# EAGLE design crocopoi-v1.5 (EAGLE 9.1.2)
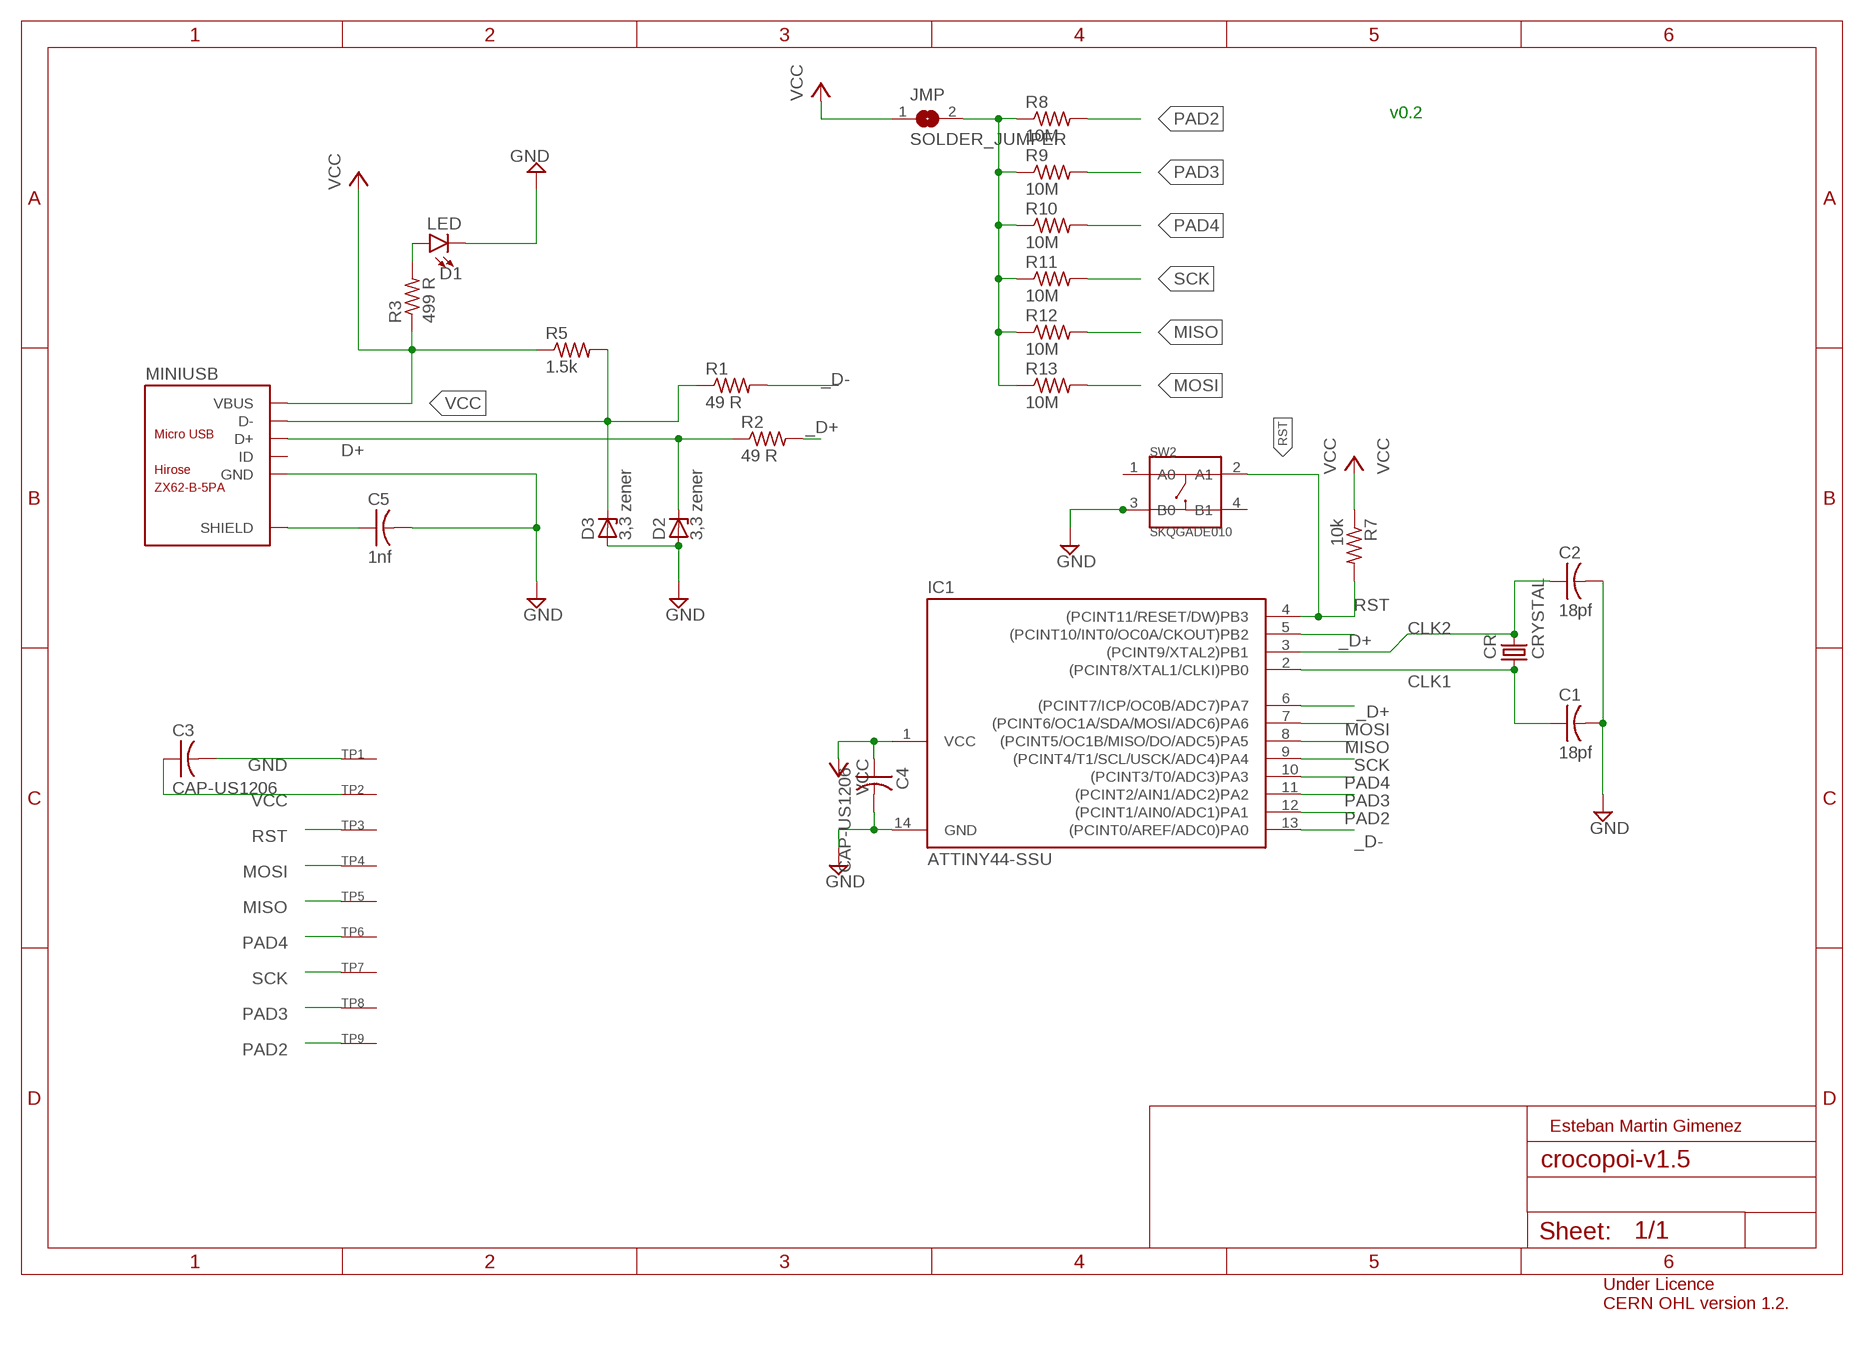
[diagram p0: schematic, sheet 1]

## Parts
C1  18pf  CAP-US1206FAB  [C1206FAB]
C2  18pf  CAP-US1206FAB  [C1206FAB]
C3  CAP-US1206  [C1206]
C4  CAP-US1206  [C1206]
C5  1nf  CAP-US1206FAB  [C1206FAB]
CR  CRYSTAL  [2-SMD-5X3MM]
D1  LED  LED1206  [LED-1206]
D2  3,3 zener  ZENER_DIODESOD123  [SOD123]
D3  3,3 zener  ZENER_DIODESOD123  [SOD123]
IC1  ATTINY44-SSU  [SOIC14]
JMP  SOLDER_JUMPER  [SJFAB]
MINIUSB  ZX62-B-5PA  MICRO-USB-SMD(ZX62-B-5PA)  [MICRO-USB5+6P-SMD-0.65-AB]
R1  49 R  RES-US1206FAB  [R1206FAB]
R2  49 R  RES-US1206FAB  [R1206FAB]
R3  499 R  RES-US1206FAB  [R1206FAB]
R5  1.5k  RES-US1206FAB  [R1206FAB]
R7  10k  RES-US1206FAB  [R1206FAB]
R8  10M  RES-US1206FAB  [R1206FAB]
R9  10M  RES-US1206FAB  [R1206FAB]
R10  10M  RES-US1206FAB  [R1206FAB]
R11  10M  RES-US1206FAB  [R1206FAB]
R12  10M  RES-US1206FAB  [R1206FAB]
R13  10M  RES-US1206FAB  [R1206FAB]
SW2  SKQGADE010  SMD-BUTTON(4P-5.2X5.2X1.5MM-SKQGADE010)-SKQGADE010  [SW4-SMD-5.2X5.2X1.5MM]
TP1  SEWTAPBIG  [BIGTAP]
TP2  SEWTAPBIG  [BIGTAP]
TP3  SEWTAPBIG  [BIGTAP]
TP4  SEWTAPBIG  [BIGTAP]
TP5  SEWTAPBIG  [BIGTAP]
TP6  SEWTAPBIG  [BIGTAP]
TP7  SEWTAPBIG  [BIGTAP]
TP8  SEWTAPBIG  [BIGTAP]
TP9  SEWTAPBIG  [BIGTAP]

## Nets
_D+: IC1.5((PCINT10/INT0/OC0A/CKOUT)PB2) IC1.6((PCINT7/ICP/OC0B/ADC7)PA7) R2.2
_D-: IC1.13((PCINT0/AREF/ADC0)PA0) R1.2
CLK1: C1.1 CR.P$1 IC1.2((PCINT8/XTAL1/CLKI)PB0)
CLK2: C2.1 CR.P$2 IC1.3((PCINT9/XTAL2)PB1)
D+: D2.CATHODE MINIUSB.3(D+) R2.1
D-: D3.CATHODE MINIUSB.2(D-) R1.1 R5.2
GND: C1.2 C2.2 C3.2 C4.2 C5.2 D1.C D2.ANODE D3.ANODE IC1.14(GND) MINIUSB.5(GND) SW2.3(B0) TP1.P$1(SEW)
MISO: IC1.8((PCINT5/OC1B/MISO/DO/ADC5)PA5) R12.2 TP5.P$1(SEW)
MOSI: IC1.7((PCINT6/OC1A/SDA/MOSI/ADC6)PA6) R13.2 TP4.P$1(SEW)
N$1: JMP.2 R8.1 R9.1 R10.1 R11.1 R12.1 R13.1
N$8: D1.A R3.2
PAD2: IC1.12((PCINT1/AIN0/ADC1)PA1) R8.2 TP9.P$1(SEW)
PAD3: IC1.11((PCINT2/AIN1/ADC2)PA2) R9.2 TP8.P$1(SEW)
PAD4: IC1.10((PCINT3/T0/ADC3)PA3) R10.2 TP6.P$1(SEW)
RST: IC1.4((PCINT11/RESET/DW)PB3) R7.2 SW2.2(A1) TP3.P$1(SEW)
SCK: IC1.9((PCINT4/T1/SCL/USCK/ADC4)PA4) R11.2 TP7.P$1(SEW)
SHIELD: C5.1 MINIUSB.P1(SHIELD) MINIUSB.P2(SHIELD) MINIUSB.P3(SHIELD) MINIUSB.P4(SHIELD) MINIUSB.P5(SHIELD) MINIUSB.P6(SHIELD)
VCC: C3.1 C4.1 IC1.1(VCC) JMP.1 MINIUSB.1(VBUS) R3.1 R5.1 R7.1 TP2.P$1(SEW)
Unconnected: MINIUSB.4(ID) SW2.1(A0) SW2.4(B1)

## Notes on the sheet
- v0.2
- Esteban Martin Gimenez
- Under Licence 
  CERN OHL version 1.2.

## Library data of the parts
C1-C5 = fab:CAP-US
CR = fab:CRYSTAL
D1 = SparkFun-LED:LED: LED (Generic) Standard schematic elements and footprints for 5mm, 3mm, 1206, and 0603 sized LEDs. Generic LEDs with no color specified.
D2 D3 = fab:ZENER_DIODE: zener diode
IC1 = fab:ATTINY44
JMP = fab:SOLDER_JUMPER
MINIUSB = Seeed-Connector:MICRO-USB-SMD(ZX62-B-5PA): 320010005; MPN: ZX62-B-5PA
R1-R3 R5 R7-R13 = fab:RES-US: Resistor (US Symbol) Variants with postfix FAB are widened to allow the routing of internal traces
SW2 = Seeed-Switch:SMD-BUTTON(4P-5.2X5.2X1.5MM-SKQGADE010): 311020017; MPN: SKQGADE010
TP1-TP9 = adafruit:SEWTAP

## Board
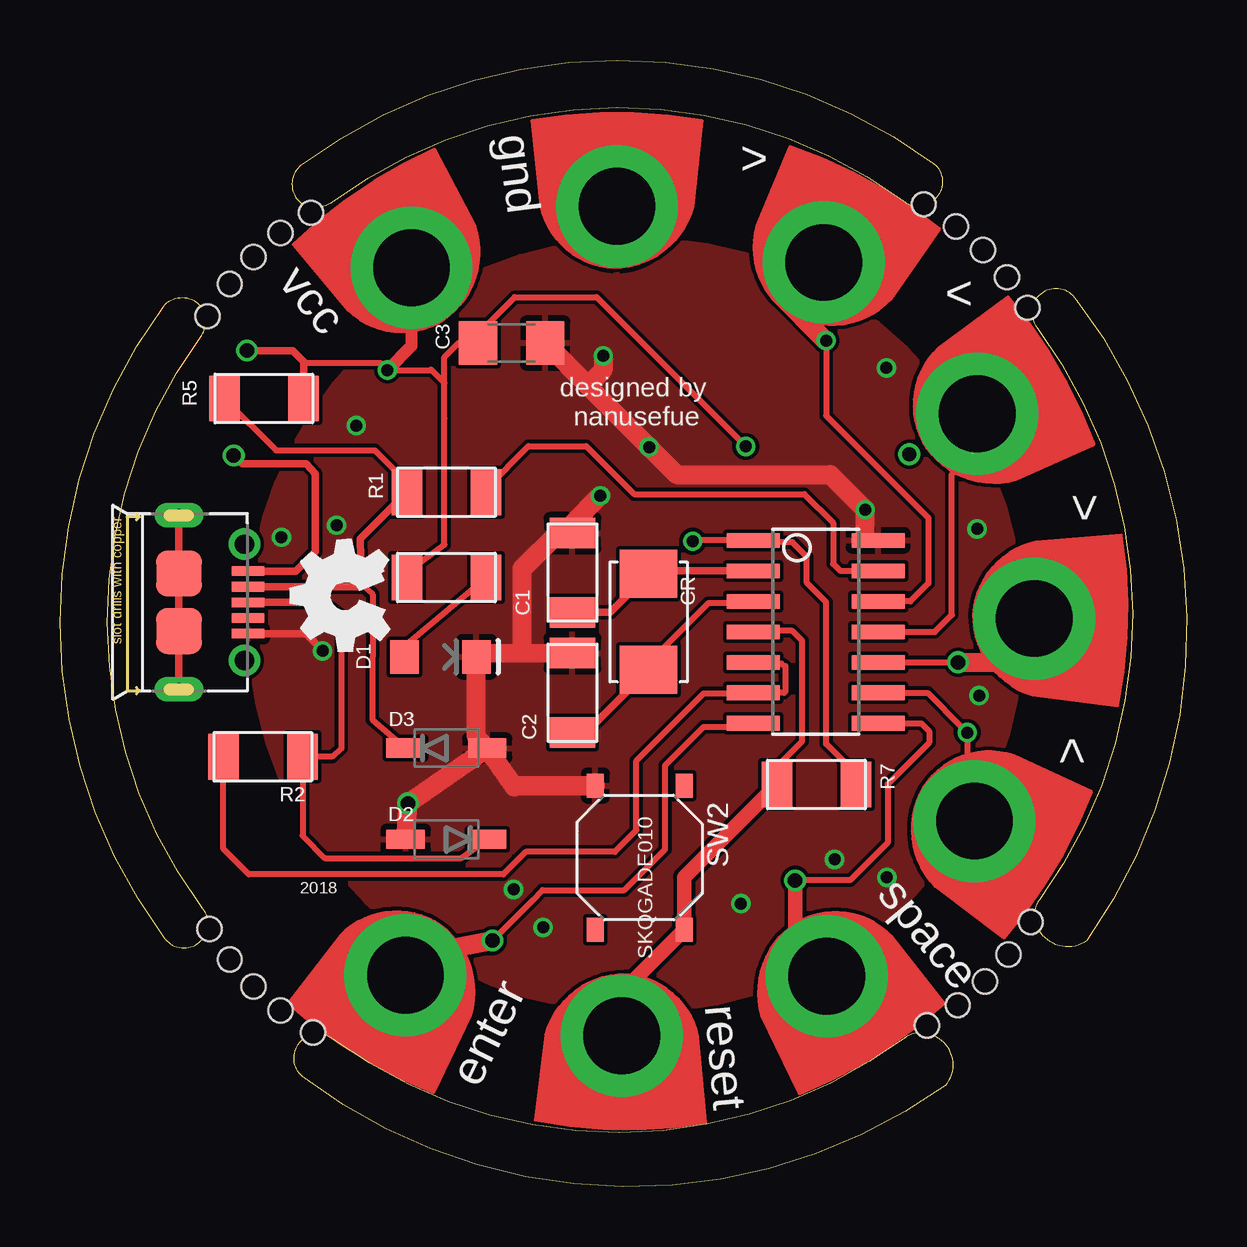
[diagram p1: board, top side]
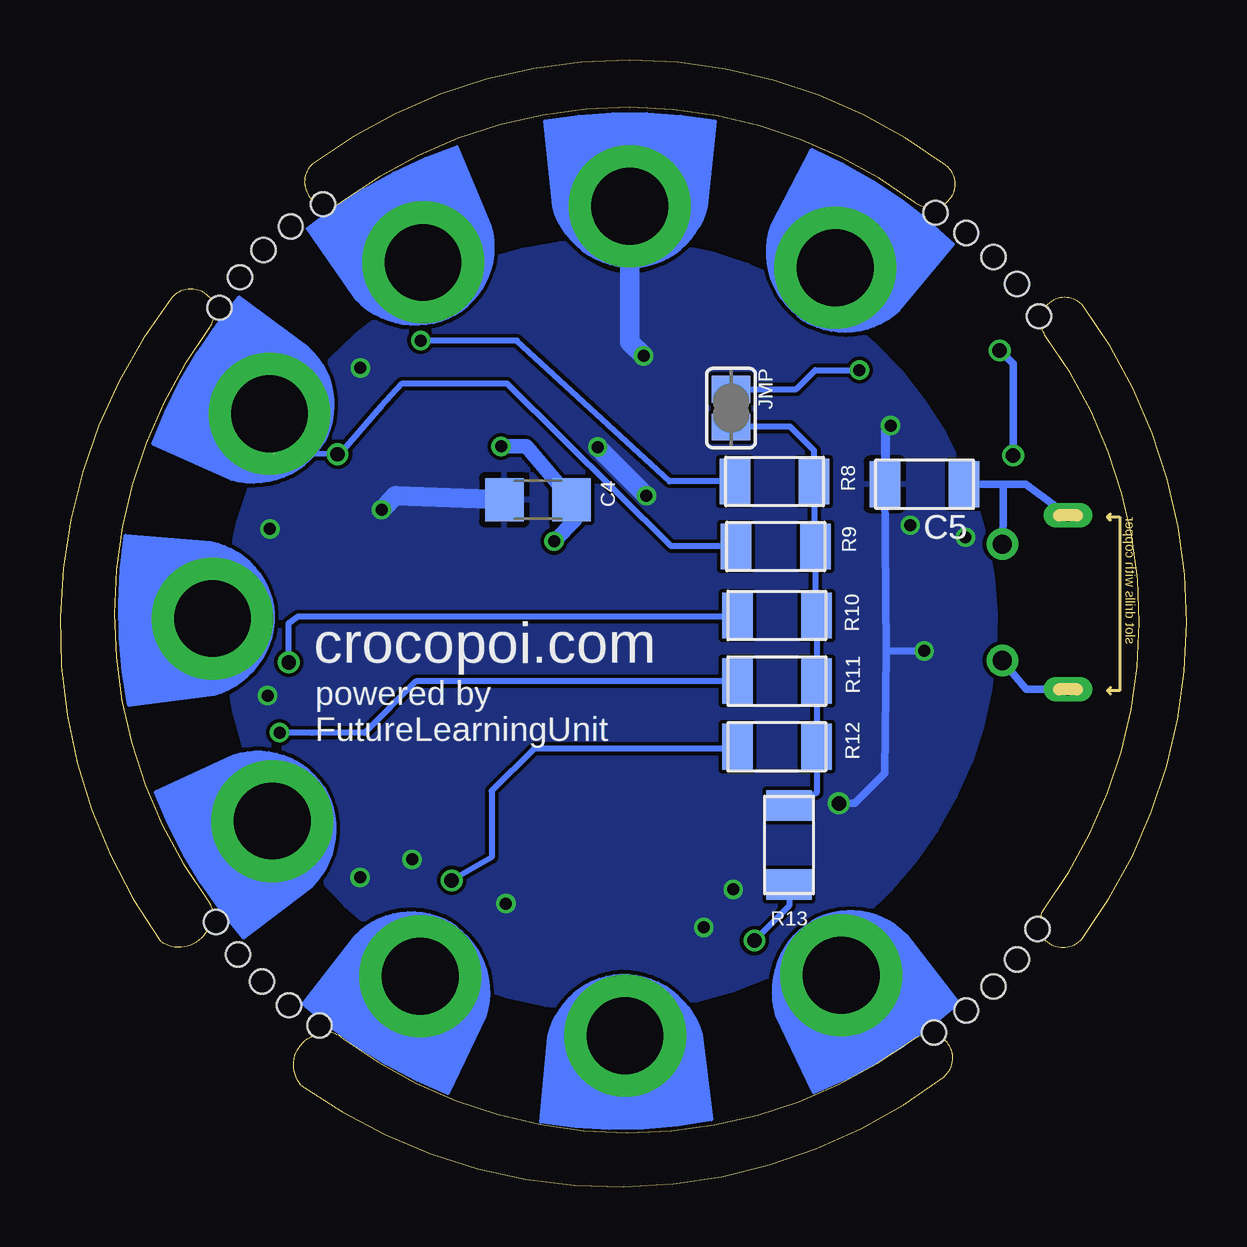
[diagram p2: board, bottom side, seen from below]

Size 46.95 x 46.95 mm. Coordinates in mm from the lower left corner, seen from the top.
Outline: 11.31,41 arc-73 35.14,41.08 arc23 35.48,40.9
Outline: 4.31,36.7 arc73 4.38,10.32 arc101 5.94,10.32
Outline: 4.31,36.7 arc-101 5.88,36.68 arc101 4.31,36.7
Outline: 10.11,40.94 arc-107 10.04,42.57 arc-73 36.42,42.64 arc-96 36.45,41.15
Outline: 11.31,41.01 arc-24 10.9,40.83
Outline: 6.04,35.78 arc-18 5.87,35.42 arc73 5.94,11.6 arc-23 6.11,11.24
Outline: 40.72,35.79 arc-73 40.8,11.95 arc23 40.6,11.51
Outline: 40.66,36.98 arc-107 42.29,37.05 arc-73 42.78,10.25 arc-96 40.8,10.69
Outline: 40.73,35.78 arc-24 40.55,36.2
Outline: 10.11,4.6 arc73 36.91,4.24 arc107 36.42,6.29
Outline: 10.11,4.6 arc-101 10.13,6.16 arc101 10.11,4.6
Outline: 11.03,6.32 arc-18 11.38,6.15 arc73 35.21,6.22 arc-31 35.71,6.43
Copper layers (1*16): Top 0.035mm / dielectric 1.5mm / Bottom 0.035mm
Design rules "SeeedStudio_2layer_DRU_no_angle_20140221": minimum track width 6mil, minimum drill 12mil, track to track 6mil, track to pad 6mil, pad to pad 6mil, via to via 6mil, smd to smd 0mil, copper to edge 10mil, drill to drill 10mil, minimum pad ring 10mil, minimum via ring 6mil, stop-mask expansion 2mil, vias tented up to drill 100mil, thermal gap 10mil
Holes 1 mm at 6.22,10.75 10.54,6.43 8.06,8.34 7.07,9.47 9.19,7.35 10.47,40.59 9.19,39.74 8.06,38.75 7.07,37.62 6.15,36.27 35.99,40.94 37.34,40.02 38.47,39.03 40.3,36.63 39.46,37.9 40.45,11.03 39.53,9.69 38.54,8.56 37.41,7.57 36.13,6.72

### Footprints (pad centres in the part's own frame; a part is rotated, then mirrored left to right if it is on the bottom)
C1206FAB = smd 1.27 x 1.905: 1 -1.651,0; 2 1.651,0
C1206 = smd 1.6 x 1.8: 1 -1.4,0; 2 1.4,0
2-SMD-5X3MM = smd 2 x 2.4: P$1 -2,0; P$2 2,0
LED-1206 = smd 1.2 x 1.4: A -1.5,0; C 1.5,0
SOD123 = smd 1.6 x 0.8: ANODE 1.7,0; CATHODE -1.7,0
SOIC14 = smd 0.61 x 2.21: 1 -3.81,-2.603; 2 -2.54,-2.603; 3 -1.27,-2.603; 4 0,-2.603; 5 1.27,-2.603; 6 2.54,-2.603; 7 3.81,-2.603; 8 3.81,2.603; 9 2.54,2.603; 10 1.27,2.603; 11 0,2.603; 12 -1.27,2.603; 13 -2.54,2.603; 14 -3.81,2.603
SJFAB = smd 1.118 x 1.6: 1 -0.787,0; 2 0.787,0
MICRO-USB5+6P-SMD-0.65-AB = smd 0.4 x 1.35: 1 -1.3,2.875; 2 -0.65,2.875; 3 0,2.875; 4 0.65,2.875; 5 1.3,2.875 | smd 1.9 x 1.9: P1 -1.2,0; P2 1.2,0 | drill 0.508 pad 1.016 long: P3 -3.625,0; P4 3.625,0 | drill 0.8: P5 -2.425,2.73; P6 2.425,2.73
R1206FAB = smd 1.27 x 1.905: 1 -1.651,0; 2 1.651,0
SW4-SMD-5.2X5.2X1.5MM = smd 1 x 0.7: 1 -3,1.85; 2 3,1.85; 3 -3,-1.85; 4 3,-1.85
BIGTAP = drill 3.2 pad 5.08: P$1 0,0

### Placement (x,y rotation side)
C1  21.35,25.59 90 top
C2  21.35,20.58 90 top
C3  18.82,35.16 0 top
C4  27.03,28.62 180 bottom
C5  10.93,29.28 180 bottom
CR  24.53,23.54 270 top
D1  15.85,22.08 0 top
D2  16.1,14.48 180 top
D3  16.1,18.28 0 top
IC1  31.49,23.12 270 top
JMP  18.99,32.45 270 bottom
MINIUSB  4.96,24.35 270 top
R1  16.1,28.94 0 top
R2  8.45,17.92 180 top
R3  16.1,25.38 0 top
R5  8.5,32.84 180 top
R7  31.52,16.76 180 top
R8  17.18,29.39 180 bottom
R9  17.13,26.68 180 bottom
R10  17.08,23.8 180 bottom
R11  17.08,21.07 180 bottom
R12  17.08,18.34 180 bottom
R13  16.57,14.24 270 bottom
SW2  24.16,13.72 270 top
TP1  23.21,40.86 0 top
TP2  14.65,38.3 33.8 top
TP3  23.41,6.29 179.2 top
TP4  14.39,8.82 211.6 bottom
TP5  31.94,8.78 211.8 top
TP6  40.6,23.68 268.8 top
TP7  38.1,15.24 239 top
TP8  38.22,32.22 300.3 top
TP9  31.82,38.52 331.3 top

### Tracks (layer width: path | path; a pad name or v marks a point on that pad's centre or on a via)
_D+
  Top 0.254: 19.41,13.96 18.48,13.02 7.87,13.02 6.8,14.09 R2.2
  Top 0.26: 19.41,13.96 23.12,13.96 24.02,14.86 24.02,17.76 26.82,20.56 28.86,20.56 IC1.6 30.17,20.58 30.23,20.65 30.23,21.69 30.06,21.8 28.93,21.8 IC1.5
_D-
  Top 0.26: IC1.13 32.52,25.66 32.22,25.96 32.22,27.66 31.02,28.86 23.92,28.86 21.92,30.86 19.52,30.86 17.75,29.1 R1.2
CLK1
  Top 0.305: C1.1 22.92,23.94 CR.P$1 24.65,25.66 IC1.2
CLK2
  Top 0.26: IC1.3 28.81,24.32 27.01,24.32 24.53,21.83
  Top 0.305: C2.1 21.92,18.93 CR.P$2 24.53,21.83
D+
  Top 0.254: 11.72,23.8 11.72,18.27 11.33,17.93 R2.1 10.11,14.63 10.15,14.59
  Top 0.26: 10.15,14.59 11.04,13.7 16.71,13.7 D2.CATHODE
  Top 0.305: MINIUSB.3 10.97,24.35 11.72,23.8
D-
  Top 0.254: R5.2 9.01,30.68 13.12,30.68 14.45,29.35 R1.1
  Top 0.26: 12.56,25.35 12.62,25.06 13.02,24.68 13.02,19.46 D3.CATHODE
  Top 0.305: R1.1 12.51,27 12.56,25.35 12.55,25 MINIUSB.2
GND  (via drill 0.5, 0.5 pad 0.81, 0.6)
  Top 0.16: 33.34,26.93 33.55,27.15
  Top 0.305: MINIUSB.5 10.26,23.05 v10.94,22.33
  Top 0.31: IC1.14 33.34,26.93
  Top 0.8: D2.ANODE v14.5,15.98 D3.ANODE | 18.92,16.66 D3.ANODE | 33.55,27.15 v33.55,28.21 32.09,29.67 25.71,29.67 24.56,30.82 | D3.ANODE 17.35,18.73 D1.C 17.75,22.23 19.27,22.25 | 19.27,22.25 C2.2 | 19.27,22.25 19.27,25.74 | C3.2 21.99,33.39 | 21.99,33.39 24.56,30.82 | C1.2 21.39,27.65 v22.52,28.79 | v24.54,30.82 24.56,30.82 | v22.63,34.62 22.63,34.03 21.99,33.39
  Top 0.813: SW2.3 18.98,16.72 18.92,16.66 | 19.27,25.74 20.77,27.24 C1.2
  Bottom 0.305: v12.34,31.72 12.58,31.48 C5.2 12.53,22.32 | v10.94,22.33 12.53,22.32 | 12.53,22.32 12.58,17.23 13.84,15.98 v14.5,15.98 | 12.52,29.72 12.52,31.93
  Bottom 0.8: 33,28.77 v33.55,28.21 | v22.52,28.79 v24.54,30.82
  Bottom 0.813: C4.2 32.97,28.8 33,28.77 | TP1.P$1 23.21,35.19 v22.63,34.62
  other vias: 20.13,10.81 18.9,12.39 11.52,27.57 28.37,11.8 32.28,13.65 38.21,27.41 34.43,34.12 34.45,12.9 38.3,20.46 9.22,27.07
  pour Top: 9.07,29.37 arc-180 38.95,17.43 arc-180
  pour Bottom: 22,7.51 arc180 26.07,39.3 arc180
MISO  (via drill 0.6)
  Top 0.254: IC1.8 35.89,19.31 36.22,18.99 36.22,18.51 34.49,16.78 34.49,14.32 34.48,14.32 32.93,12.78 v30.63,12.76
  Top 0.61: v30.63,12.76 30.63,10.24 TP5.P$1
  Bottom 0.254: 25.72,18.26 27.2,18.26 28.96,16.5 28.96,13.73 v30.63,12.76
  Bottom 0.26: R12.2 18.62,18.26 25.72,18.26
MOSI  (via drill 0.6)
  Top 0.26: v18.02,10.26 19.72,11.96 20.1,12.36 23.52,12.36 25.22,14.06 25.22,17.56 26.82,19.16 28.73,19.16 IC1.7
  Top 0.8: v18.02,10.26 15.22,9.71 TP4.P$1
  Bottom 0.254: R13.2 16.57,11.71 v18.02,10.26
N$1
  Bottom 0.254: R8.1 15.53,30.67 16.53,31.68 18.97,31.68 JMP.2
  Bottom 0.26: R8.1 15.53,26.73 R9.1 15.48,23.85 R10.1 R11.1 R12.1 15.43,16.41 R13.1
N$8
  Top 0.26: D1.A 14.58,22.08 14.58,22.71 R3.2
PAD2  (via drill 0.5)
  Top 0.254: v31.92,35.26 31.92,32.14 36.18,27.88 36.18,25.14 35.43,24.39 IC1.12
  Top 0.26: v31.92,35.26 v31.91,35.25
  Top 0.8: v31.91,35.25 29.92,37.26 29.88,40.56 TP9.P$1
  Bottom 0.26: R8.2 21.55,29.39 27.92,35.26 v31.92,35.26
PAD3  (via drill 0.6)  (1 unrouted)
  Top 0.254: IC1.11 36.45,23.12 37.16,23.83 37.16,29.69 38.02,30.56
  Top 0.8: 38.02,30.56 36.89,32.88 TP8.P$1
  Bottom 0.26: 38.06,30.55 v35.39,30.52 35.31,30.5 33.58,32.5 32.72,33.46 28.32,33.46 21.48,26.69 R9.2
PAD4  (via drill 0.6)
  Top 0.26: IC1.10 v37.42,21.85 | 40.62,22.28 TP6.P$1
  Top 0.8: v37.42,21.85 40.19,21.85 40.62,22.28
  Bottom 0.26: v37.42,21.85 37.42,23.48 37.04,23.76 18.92,23.76 18.82,23.56 R10.2
RST
  Top 0.26: R7.2 29.87,17.51 30.92,18.56 30.92,22.76 30.52,23.16 28.92,23.16 IC1.4 | TP3.P$1 22.8,6.81
  Top 0.61: R7.2 26.01,12.9 SW2.2 21.8,6.52 22.8,6.81
SCK  (via drill 0.5)
  Top 0.254: v37.8,18.93 37.8,15.54 TP7.P$1
  Top 0.26: IC1.9 36.15,20.58 37.57,19.16 37.85,18.87 v37.8,18.93
  Bottom 0.26: R11.2 30.23,21.06 32.12,21.06 34.26,18.92 36.44,18.92 v37.8,18.93
SHIELD
  Top 0.305: MINIUSB.P3 MINIUSB.P1 MINIUSB.P2 MINIUSB.P4
  Bottom 0.305: MINIUSB.P3 6.7,29.27 7.65,29.27 | 7.65,29.27 C5.1 | MINIUSB.P5 7.65,27.74 7.65,29.27 | MINIUSB.P4 6.69,20.73 MINIUSB.P6
VCC  (via drill 0.5, 0.6)
  Top 0.254: 16.02,32.01 16.02,33.49 15.46,34.05 15.44,34.03 v13.64,34.03 13.35,34.33 | 10.16,34.33 13.35,34.33 | 13.35,34.33
  Top 0.26: R7.1 33.17,17.21 31.92,18.46 31.92,24.36 31.12,25.16 31.12,26.26 30.52,26.86 28.96,26.86 IC1.1 26.4,26.93 v26.37,26.9 | R3.1 14.14,25.38 16.02,26.76 16.02,32.01 16.02,34.57 16.61,35.16 C3.1 17.42,35.54 18.94,37.07 22.36,37.07 v28.57,30.85
  Top 0.305: MINIUSB.1 9.83,25.65 10.63,26.46 10.63,29.7 10.26,30.12 7.59,30.12 v7.24,30.47 | v7.8,34.84 9.69,34.84 10.16,34.37 10.16,34.33 10.16,32.85 R5.1
  Top 0.508: TP2.P$1 14.65,35.33 14.65,35.03 v13.64,34.03
  Bottom 0.254: JMP.1 16.28,33.24 15.48,34.03 v13.64,34.03
  Bottom 0.305: v7.24,30.47 7.24,34.3 7.77,34.84 v7.8,34.84
  Bottom 0.61: v26.37,26.9 25.48,27.79 C4.1 27.53,30.85 v28.57,30.85

### Text on the board
_tPlace: SW2
_tNames: gnd | > | < | vcc | C3 | R5 | designed by / nanusefue | < | R1 | R3 | CR | C1 | D1 | D3 | C2 | R7 | > | R2 | D2 | 2018 | space | enter | reset
_bNames: JMP | R8 | C5 | C4 | R9 | R10 | R11 | crocopoi.com | R12 | powered by / FutureLearningUnit | R13